# Altium project calculator.PrjPcb
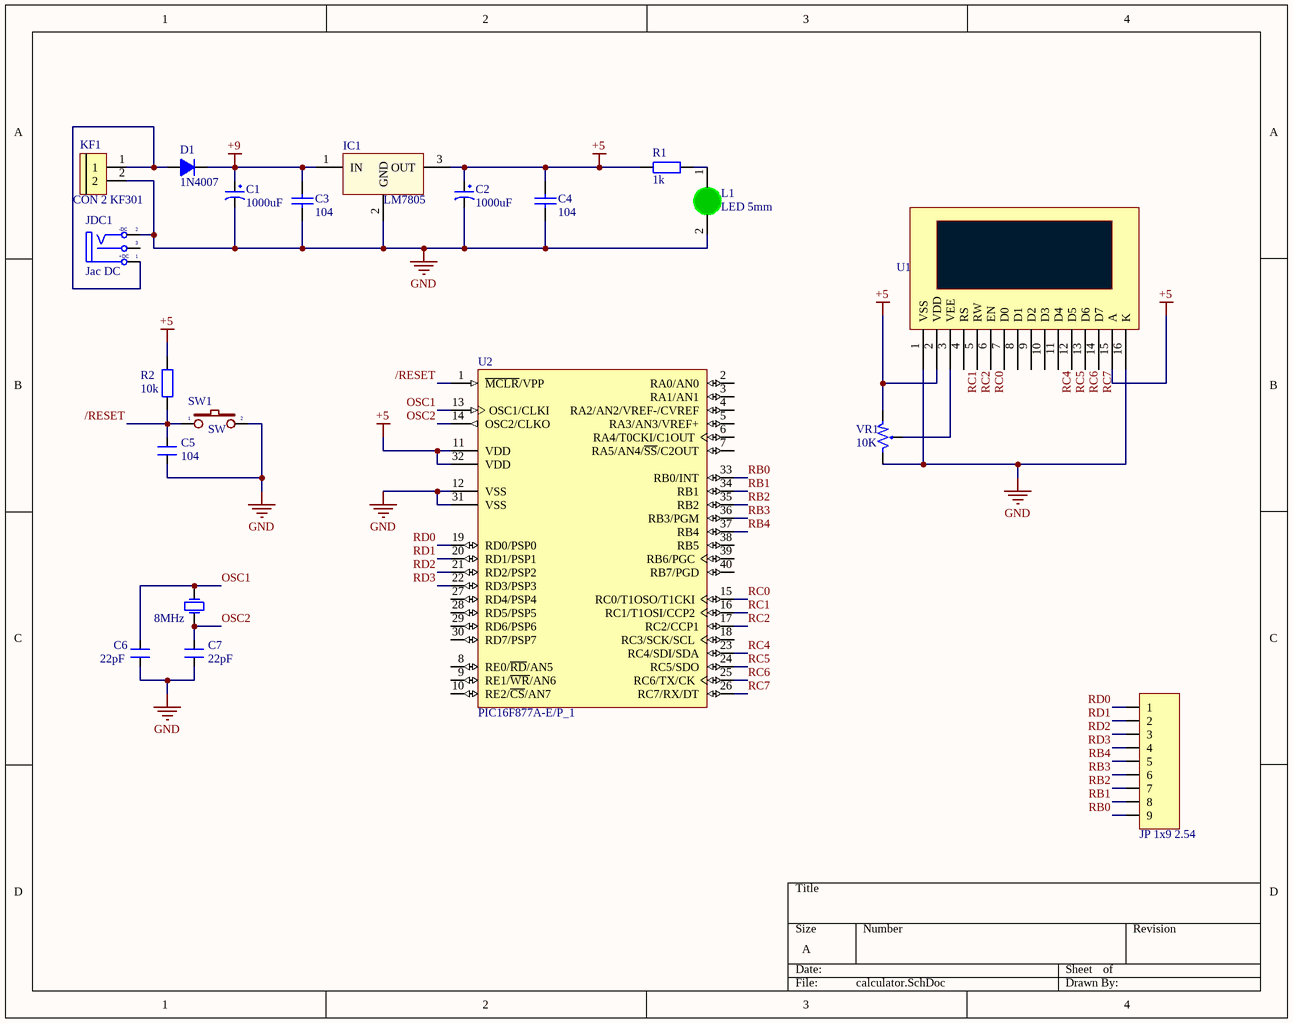
[diagram p0: calculator.SchDoc]
1 sheet, 20 parts. Net scope: global (net labels, ports and power ports of the same name join across sheets).
Board file: calculator.PcbDoc

## Sheet calculator.SchDoc
size A; SheetNumber: 1; SheetTotal: 1

### Parts
C1  1000uF  [tu hoa 8mm]
C2  1000uF  [tu hoa 8mm]
C3  104  [tu gom]
C4  104  [tu gom]
C5  104  [CN1.5]
C6  22pF  [CN1.5]
C7  22pF  [CN1.5]
D1  1N4007  [D1A]
IC1  LM7805  [QTO-220]
JDC1  Jac DC  [DC-IN]
JP1  JP 1x9 2.54  [JP 1x9 DT]
KF1  CON 2 KF301  [Con 2 KF301 5.08]
L1  LED 5mm  [LED-5MM-Green]
R1  1k  [tro vach 1/4w]
R2  10k  [R1/4W]
SW1  SW  [SW2]
U1  LCD  [LCD16X2]  (value not drawn)
U2  PIC16F877A-E/P_1  [PDIP600-P40]
VR1  10K  [VR1]
Y1  8MHz  [XT2]

### Nets
+5: C2.1 C4.1 IC1.3(OUT) R1.2 R2.2 U1.2(VDD) U1.15(A) U2.11(VDD) U2.32(VDD) VR1.1
+9: C1.1 C3.1 D1.2(K) IC1.1(IN)
GND: C1.2 C2.2 C3.2 C4.2 C5.1 C6.1 C7.1 IC1.2(GND) JDC1.2(TN) KF1.2 L1.2(K) SW1.2 U1.1(VSS) U1.16(K) U2.12(VSS) U2.31(VSS) VR1.3
/RESET: C5.2 R2.1 SW1.1 U2.1(~{MCLR}/VPP)
OSC1: C6.2 U2.13(OSC1/CLKI) Y1.1(OSC1)
OSC2: C7.2 U2.14(OSC2/CLKO) Y1.2(OSC2)
RB0: JP1.9 U2.33(RB0/INT)
RB1: JP1.8 U2.34(RB1)
RB2: JP1.7 U2.35(RB2)
RB3: JP1.6 U2.36(RB3/PGM)
RB4: JP1.5 U2.37(RB4)
RC0: U1.6(EN) U2.15(RC0/T1OSO/T1CKI)
RC1: U1.4(RS) U2.16(RC1/T1OSI/CCP2)
RC2: U1.5(RW) U2.17(RC2/CCP1)
RC4: U1.11(D4) U2.23(RC4/SDI/SDA)
RC5: U1.12(D5) U2.24(RC5/SDO)
RC6: U1.13(D6) U2.25(RC6/TX/CK)
RC7: U1.14(D7) U2.26(RC7/RX/DT)
RD0: JP1.1 U2.19(RD0/PSP0)
RD1: JP1.2 U2.20(RD1/PSP1)
RD2: JP1.3 U2.21(RD2/PSP2)
RD3: JP1.4 U2.22(RD3/PSP3)
NetD1_1: D1.1(A) JDC1.1(T) KF1.1
NetL1_1: L1.1(A) R1.1
NetU1_3: U1.3(VEE) VR1.2

Not connected (* = marked no-connect by the designer): JDC1 3(S); U1 7(D0) 8(D1) 9(D2) 10(D3); U2 2(RA0/AN0) 3(RA1/AN1) 4(RA2/AN2/VREF-/CVREF) 5(RA3/AN3/VREF+) 6(RA4/T0CKI/C1OUT) 7(RA5/AN4/~{SS}/C2OUT) 8(RE0/~{RD}/AN5) 9(RE1/~{WR}/AN6) 10(RE2/~{CS}/AN7) 18(RC3/SCK/SCL) 27(RD4/PSP4) 28(RD5/PSP5) 29(RD6/PSP6) 30(RD7/PSP7) 38(RB5) 39(RB6/PGC) 40(RB7/PGD)

### Notes on the sheet
- (in symbol DCIN) -DC; +DC

### Library data of the parts
C1 C2 = Tu Hoa 1000uF 16V 8x20: Cắm; Don_Vi: Con; So_Chan: 2; Ten_Linh_Kien: Tụ Hóa 1000uF 16V 8x20MM; Ma_Hang: MH008300; Chung_Loai: Cắm; Kieu_Chan: *
C3 C4 = Tu gom 104 50V: Cắm; So_Chan: 2; Ten_Linh_Kien: Tụ gốm 104 100nF 50V; Don_Vi: Con; Ma_Hang: MH004761; Chung_Loai: Cắm; Kieu_Chan: *
C5-C7 = CN1.5: Cap np 682pF => 104pF; Value: 0.01uF
D1 = D1A: Diode 1A; Value: 1N4007
IC1 = LM78xx: On ap +, from + 5 to + 24VDC; Value: LM7805
JDC1 = DCIN: Jac DC input; Value: Jac DC
JP1 = JP 1x9 2.54 Duc Thang: Cắm; Ten_Linh_Kien: Jump Đơn Đực 2.54MM 1x40P Thẳng 11MM; Don_Vi: Con; Ma_Hang: MH000903; Ghi_Chu: *; Kieu_Chan: *; Chung_Loai: Cắm
KF1 = CON 2 KF301: Cắm; Ma_Hang: MH000987; Ten_Linh_Kien: CON 2 KF301-2P 5.08MM Xanh Dương; Chung_Loai: Cắm; Ghi_Chu: *; Kieu_Chan: *; Don_Vi: Con
L1 = LED 5mm Xanh La: Cắm; Don_Vi: Con; Ma_Hang: MH008969; Ten_Linh_Kien: LED 5MM Phủ Xanh (1000c); Ghi_Chu: *; Kieu_Chan: *; Chung_Loai: Cắm
R1 = Tro Vach 1/4W 5% 1k: Cắm; Don_Vi: Con; So_Chan: 2; Ten_Linh_Kien: Trở Vạch 1/4w 5% 1k; Ma_Hang: MH007390; Chung_Loai: Cắm; Kieu_Chan: *
R2 = R1/4W: Resistor 1/4W; Value: R1/4W - 1K
SW1 = SW2: Switch button 2 pin; Value: SW chip 2 pin
U1 = LCD: Value: LCD16x2
U2 = PIC16F877A-E/P_1: Enhanced FLASH Microcontroller, 8K (x14-Bit words) FLASH, 368 Bytes RAM, 40-Pin PDIP, Standard VDD Range, Extended Temperature; ComponentAvailability: Unknown. Contact manufacturer to determine status.; Published: 11-Oct-2004; LatestRevisionDate: 29-Jan-2009; LatestRevisionNote: Sch. layout revised. 3D Model Removed.; DatasheetVersion: revB, Oct-2003; PackageVersion: revBB, Aug-2009; PackageReference: PDIP600-P40; Publisher: Altium Limited; PackageDescription: 40-Lead Plastic Dual In-Line (P) - 600 mil Body [PDIP]; Supplier 1: Digi-Key; Supplier Part Number 1: PIC16F877A-E/P-ND; Supplier 2: Farnell; Supplier Part Number 2: 1567990; ComponentLink1Description: Datasheet; ComponentLink1URL: http://ww1.microchip.com/downloads/en/DeviceDoc/39582b.pdf; ComponentLink2Description: Packaging Specification; ComponentLink2URL: http://www.microchip.com/stellent/groups/techpub_sg/documents/packagingspec/en012702.pdf; ComponentLink3Description: Microchip.com Home; ComponentLink3URL: http://www.microchip.com/
VR1 = VR1: Var Resistor; Value: VR 10K
Y1 = Crystal: Crystal Oscillator; Published: 8-Jun-2000; LatestRevisionDate: 17-Jul-2002; LatestRevisionNote: Re-released for DXP Platform.; PackageReference: R38; Publisher: Altium Limited